# EAGLE design board-led (EAGLE 8.4.3)
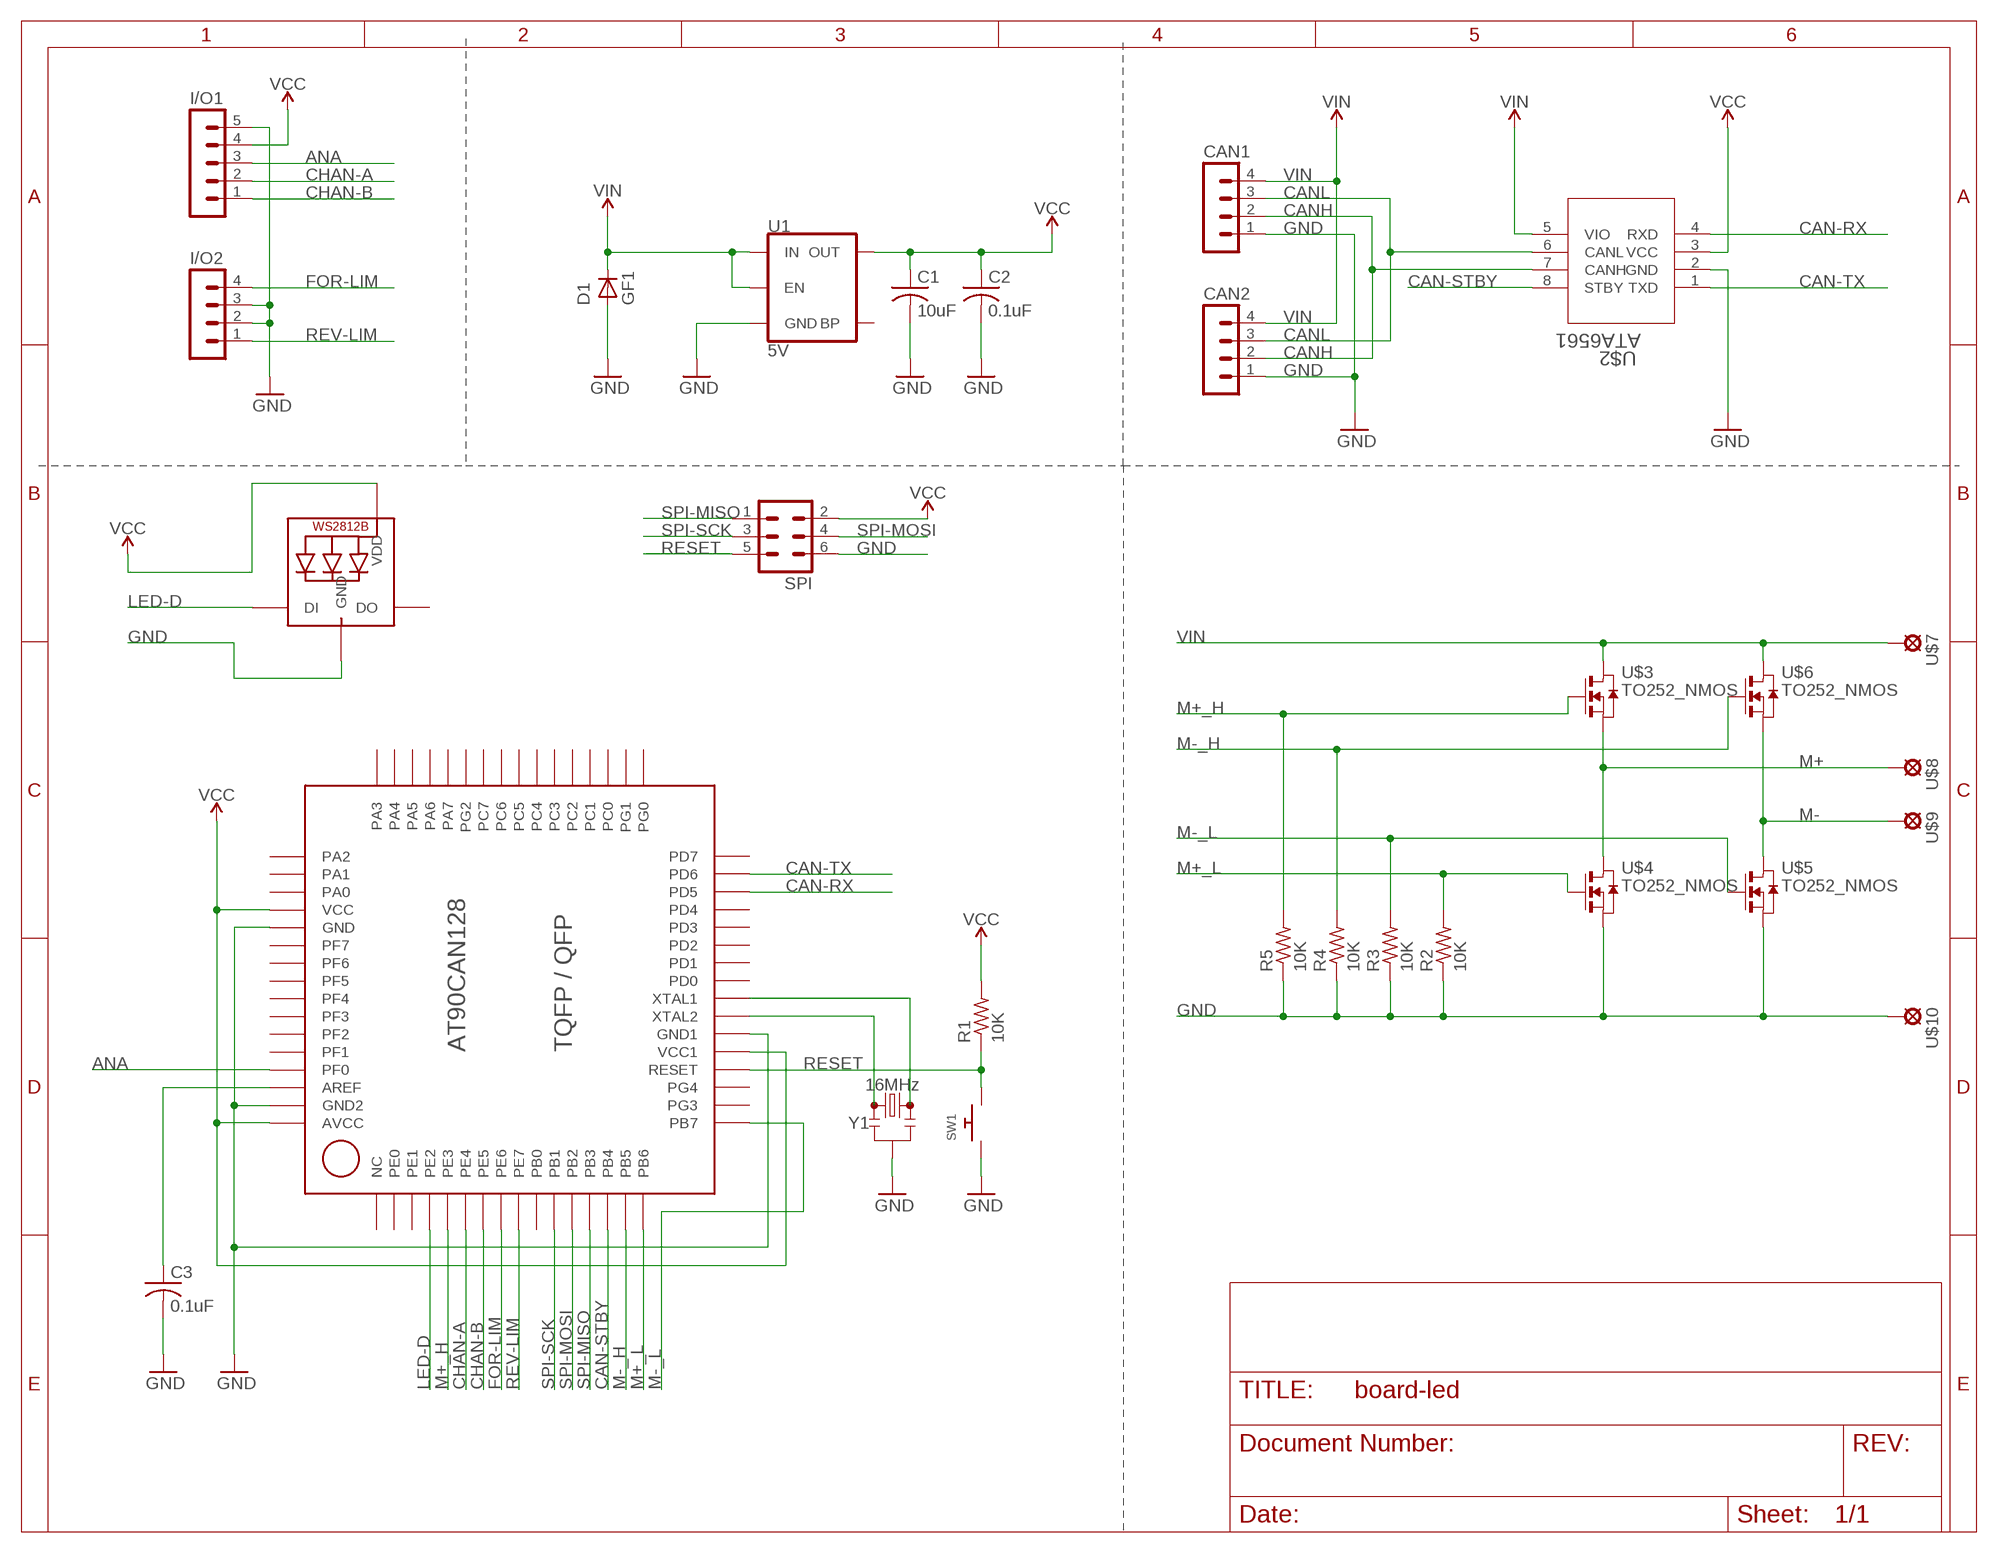
[diagram p0: schematic, sheet 1]

## Parts
C1  10uF  C-USC0603  [C0603]
C2  0.1uF  C-USC0603  [C0603]
C3  0.1uF  C-USC0603  [C0603]
CAN1  MA04-1  [MA04-1]
CAN2  MA04-1  [MA04-1]
D1  GF1  [SMA-DO214AC]
I/O1  MA05-1  [MA05-1]
I/O2  MA04-1  [MA04-1]
LED1  WS2812B3535  [LED3535]
R1  10K  R-US_R0603  [R0603]
R2  10K  R-US_R0603  [R0603]
R3  10K  R-US_R0603  [R0603]
R4  10K  R-US_R0603  [R0603]
R5  10K  R-US_R0603  [R0603]
SPI  MA03-2  [MA03-2]
SW1  SWITCH_PUSHBUTTONEVQ-PE  [TACT_PANA-EVQ]
U1  5V  V_REG_MIC52055V  [SOT23-5]
U$1  AT90CAN128  [QFP64/TQFP64]
U$2  ATA6561  [SO8]
U$3  TO252_NMOS  [TO252]
U$4  TO252_NMOS  [TO252]
U$5  TO252_NMOS  [TO252]
U$6  TO252_NMOS  [TO252]
U$7  SOLPAD  [SOLPAD]
U$8  SOLPAD  [SOLPAD]
U$9  SOLPAD  [SOLPAD]
U$10  SOLPAD  [SOLPAD]
Y1  16MHz  RESONATOR-16MHZSMD_3.2X1.3  [RESONATOR-SMD-3.2X1.3]

## Nets
ANA: I/O1.3 U$1.61(PF0)
CAN-RX: U$1.30(PD5) U$2.4(RXD)
CAN-STBY: U$1.14(PB4) U$2.8(STBY)
CAN-TX: U$1.31(PD6) U$2.1(TXD)
CANH: CAN1.2 CAN2.2 U$2.7(CANH)
CANL: CAN1.3 CAN2.3 U$2.6(CANL)
CHAN-A: I/O1.2 U$1.6(PE4)
CHAN-B: I/O1.1 U$1.7(PE5)
FOR-LIM: I/O2.4 U$1.8(PE6)
GND: C1.2 C2.2 C3.2 CAN1.1 CAN2.1 D1.A I/O1.5 I/O2.2 I/O2.3 LED1.4(GND) R2.1 R3.1 R4.1 R5.1 SPI.6 SW1.P$1 U1.2(GND) U$1.22(GND1) U$1.53(GND) U$1.63(GND2) U$2.2(GND) U$4.2(S) U$5.2(S) U$10.P$1(MP) Y1.2
LED-D: LED1.1(DI) U$1.4(PE2)
M+: U$3.2(S) U$4.3(D) U$8.P$1(MP)
M+_H: R5.2 U$1.5(PE3) U$3.1(G)
M+_L: R2.2 U$1.16(PB6) U$4.1(G)
M-: U$5.3(D) U$6.2(S) U$9.P$1(MP)
M-_H: R4.2 U$1.15(PB5) U$6.1(G)
M-_L: R3.2 U$1.17(PB7) U$5.1(G)
N$2: U$1.23(XTAL2) Y1.1
N$3: U$1.24(XTAL1) Y1.3
N$4: C3.1 U$1.62(AREF)
RESET: R1.1 SPI.5 SW1.P$2 U$1.20(RESET)
REV-LIM: I/O2.1 U$1.9(PE7)
SPI-MISO: SPI.1 U$1.13(PB3)
SPI-MOSI: SPI.4 U$1.12(PB2)
SPI-SCK: SPI.3 U$1.11(PB1)
VCC: C1.1 C2.1 I/O1.4 LED1.2(VDD) R1.2 SPI.2 U1.5(OUT) U$1.21(VCC1) U$1.52(VCC) U$1.64(AVCC) U$2.3(VCC)
VIN: CAN1.4 CAN2.4 D1.K(C) U1.1(IN) U1.3(EN) U$2.5(VIO) U$3.3(D) U$6.3(D) U$7.P$1(MP)
Unconnected: LED1.3(DO) U1.4(BP) U$1.1(NC) U$1.2(PE0) U$1.3(PE1) U$1.10(PB0) U$1.18(PG3) U$1.19(PG4) U$1.25(PD0) U$1.26(PD1) U$1.27(PD2) U$1.28(PD3) U$1.29(PD4) U$1.32(PD7) U$1.33(PG0) U$1.34(PG1) U$1.35(PC0) U$1.36(PC1) U$1.37(PC2) U$1.38(PC3) U$1.39(PC4) U$1.40(PC5) U$1.41(PC6) U$1.42(PC7) U$1.43(PG2) U$1.44(PA7) U$1.45(PA6) U$1.46(PA5) U$1.47(PA4) U$1.48(PA3) U$1.49(PA2) U$1.50(PA1) U$1.51(PA0) U$1.54(PF7) U$1.55(PF6) U$1.56(PF5) U$1.57(PF4) U$1.58(PF3) U$1.59(PF2) U$1.60(PF1)

## Library data of the parts
C1-C3 = rcl:C-US: CAPACITOR, American symbol; SPICEPREFIX: C
CAN1 CAN2 I/O2 = con-lstb:MA04-1: PIN HEADER; OC_FARNELL: unknown; OC_NEWARK: unknown
D1 = diode:GF1: DIODE
I/O1 = con-lstb:MA05-1: PIN HEADER; OC_FARNELL: unknown; OC_NEWARK: unknown
LED1 = adafruit:WS2812B
R1-R5 = rcl:R-US_: RESISTOR, American symbol; SPICEPREFIX: R
SPI = con-lstb:MA03-2: PIN HEADER; OC_FARNELL: unknown; OC_NEWARK: unknown
SW1 = adafruit:SWITCH_PUSHBUTTON: Buttons SOFTTOUCHSMD_SJ - Soft touch temporary push button (Super Junk Akihabara) Compatible with SKPMANE010 [Mouser: 688-SKPMAN] C&K_KSS = Digikey: KSS221GLFS
U1 = SparkFun-IC-Power:V_REG_MIC5205: V_REG MIC5205 Standard 3.3V, 5V, and Adjustable 150mA LDO voltage regulator in SOT-23 layout. Micrel part MIC5205. BP (by-pass) pin is used to lower output noise with 470pF cap, may be left open. On the adjustable version BP is used to set output.; PROD_ID: VREG-00823
U$1 = JetsonProj:AT90CAN128
U$2 = JetsonProj:ATA6561
U$3-U$6 = JetsonProj:TO252_NMOS
U$7-U$10 = JetsonProj:SOLPAD
Y1 = SparkFun-Clocks:RESONATOR-16MHZ: 16MHz Resonator Digikey Example <http://www.digikey.com/product-detail/en/murata-electronics-north-america/CSTCE16M0V53-R0/490-1198-1-ND/584635> Frequency: 16MHz Frequency Stability: ±0.3% Frequency Tolerance: ±0.5% Capacitance: 15pF SparkFun Products SparkFun OpenLog <https://www.sparkfun.com/products/13712> SparkFun MicroView - OLED Arduino Module <https://www.sparkfun.com/products/12923>; PROD_ID: XTAL-08900

## Board
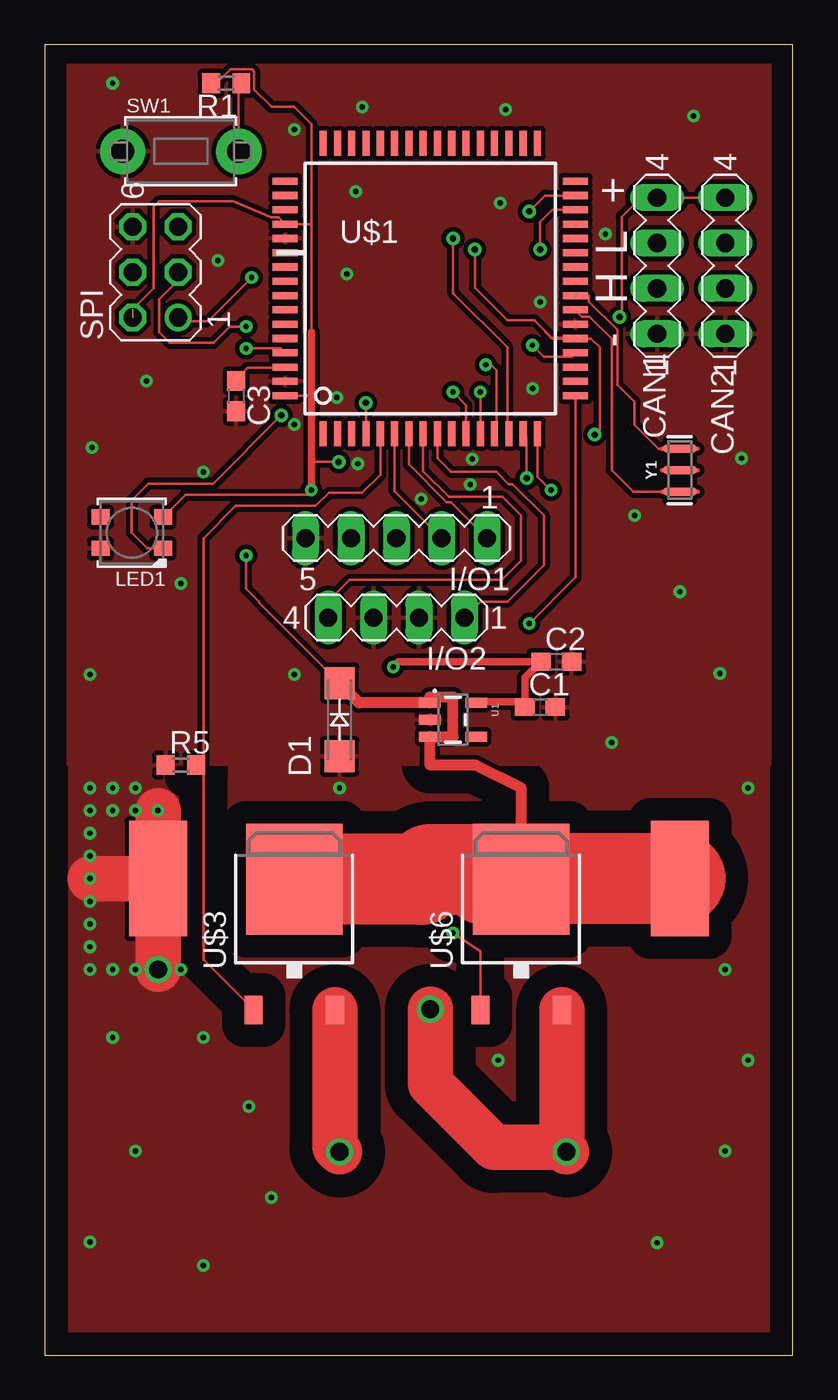
[diagram p1: board, top side]
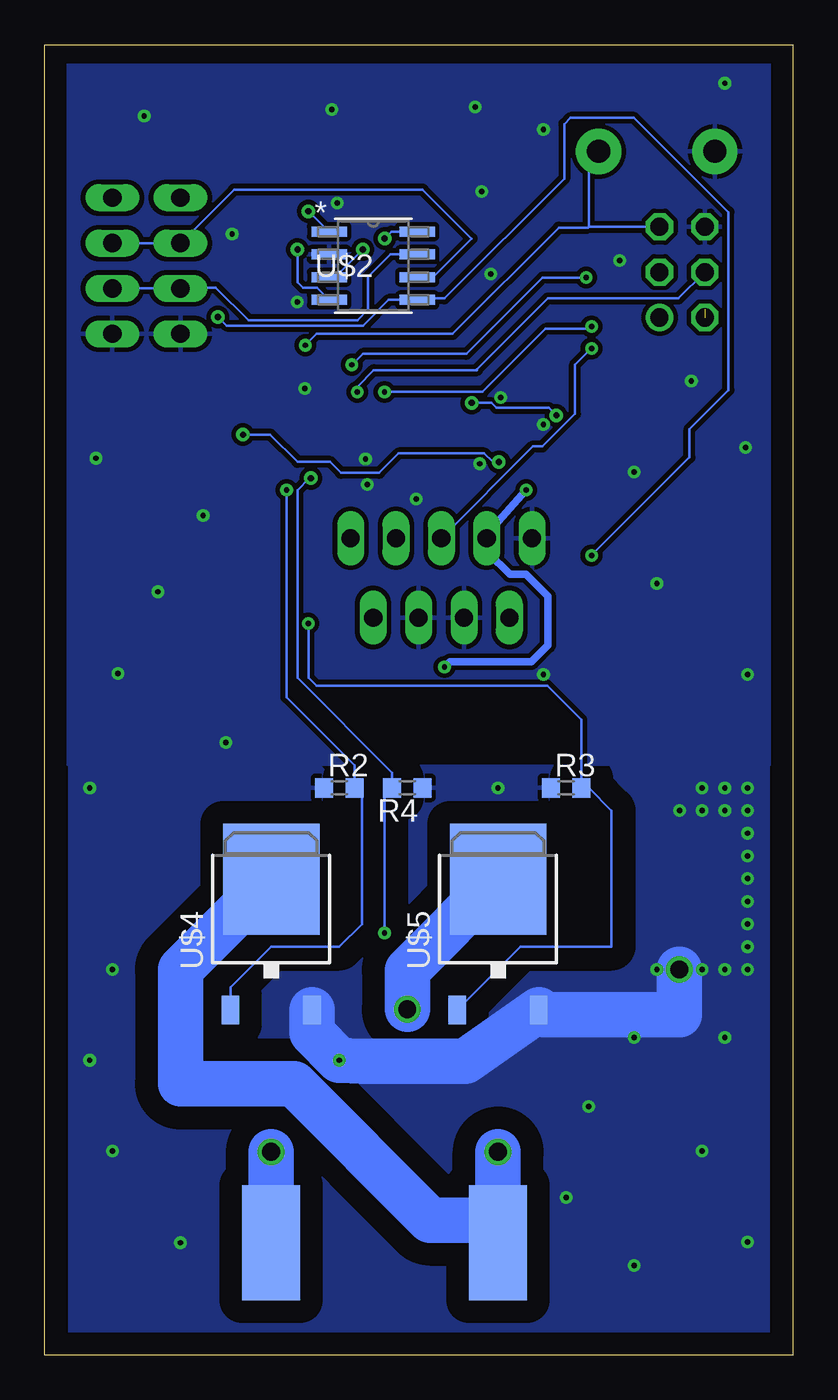
[diagram p2: board, bottom side, seen from below]

Size 41.89 x 73.33 mm. Coordinates in mm from the lower left corner, seen from the top.
Outline: 0,0 41.89,0 41.89,73.33 0,73.33 0,0
Copper layers (1*16): Top 0.035mm / dielectric 1.5mm / Bottom 0.035mm
Design rules "default": minimum track width 6mil, minimum drill 0.35mm, track to track 6mil, track to pad 6mil, pad to pad 6mil, via to via 6mil, smd to smd 6mil, copper to edge 40mil, drill to drill 6mil, minimum pad ring 10mil, minimum via ring 8mil, stop-mask expansion 4mil, vias tented up to drill 0mil, thermal gap 10mil

### Footprints (pad centres in the part's own frame; a part is rotated, then mirrored left to right if it is on the bottom)
C0603 = smd 1.1 x 1: 1 -0.85,0; 2 0.85,0
MA04-1 = drill 1.016 long: 1 -3.81,0; 2 -1.27,0; 3 1.27,0; 4 3.81,0
SMA-DO214AC = smd 1.8 x 1.7: A -2.05,0; K 2.05,0
MA05-1 = drill 1.016 long: 1 -5.08,0; 2 -2.54,0; 3 0,0; 4 2.54,0; 5 5.08,0
LED3535 = smd 1 x 0.85: 1 -1.75,0.875; 2 -1.75,-0.875; 3 1.75,-0.875; 4 1.75,0.875
R0603 = smd 1 x 1.1: 1 -0.85,0; 2 0.85,0
MA03-2 = drill 1.016: 1 -2.54,-1.27 | drill 1.016 octagon: 2 -2.54,1.27; 3 0,-1.27; 4 0,1.27; 5 2.54,-1.27; 6 2.54,1.27
TACT_PANA-EVQ = drill 1.3 pad 2.54: P$1 -3.25,0; P$2 3.25,0
SOT23-5 = smd 0.55 x 1.2: 1 -0.95,-1.3; 2 0,-1.3; 3 0.95,-1.3; 4 0.95,1.3; 5 -0.95,1.3
QFP64/TQFP64 = smd 0.4 x 1.4: 1 -6,-8.125; 2 -5.2,-8.125; 3 -4.4,-8.125; 4 -3.6,-8.125; 5 -2.8,-8.125; 6 -2,-8.125; 7 -1.2,-8.125; 8 -0.4,-8.125; 9 0.4,-8.125; 10 1.2,-8.125; 11 2,-8.125; 12 2.8,-8.125; 13 3.6,-8.125; 14 4.4,-8.125; 15 5.2,-8.125; 16 6,-8.125; 33 6,8.125; 34 5.2,8.125; 35 4.4,8.125; 36 3.6,8.125; 37 2.8,8.125; 38 2,8.125; 39 1.2,8.125; 40 0.4,8.125; 41 -0.4,8.125; 42 -1.2,8.125; 43 -2,8.125; 44 -2.8,8.125; 45 -3.6,8.125; 46 -4.4,8.125; 47 -5.2,8.125; 48 -6,8.125 | smd 1.4 x 0.4: 17 8.125,-6; 18 8.125,-5.2; 19 8.125,-4.4; 20 8.125,-3.6; 21 8.125,-2.8; 22 8.125,-2; 23 8.125,-1.2; 24 8.125,-0.4; 25 8.125,0.4; 26 8.125,1.2; 27 8.125,2; 28 8.125,2.8; 29 8.125,3.6; 30 8.125,4.4; 31 8.125,5.2; 32 8.125,6; 49 -8.125,6; 50 -8.125,5.2; 51 -8.125,4.4; 52 -8.125,3.6; 53 -8.125,2.8; 54 -8.125,2; 55 -8.125,1.2; 56 -8.125,0.4; 57 -8.125,-0.4; 58 -8.125,-1.2; 59 -8.125,-2; 60 -8.125,-2.8; 61 -8.125,-3.6; 62 -8.125,-4.4; 63 -8.125,-5.2; 64 -8.125,-6
SO8 = smd 1.981 x 0.559: 1 -2.464,1.905; 2 -2.464,0.635; 3 -2.464,-0.635; 4 -2.464,-1.905; 5 2.464,-1.905; 6 2.464,-0.635; 7 2.464,0.635; 8 2.464,1.905
TO252 = smd 1 x 1.6: 1 -2.28,-6.07; 2 2.28,-6.07 | smd 5.4 x 6.2: 3 0,1.23
SOLPAD = smd 3.251 x 6.452: P$1 0,0
RESONATOR-SMD-3.2X1.3 = smd 0.45 x 1.905: 1 -1.2,0; 2 0,0; 3 1.2,0

### Placement (x,y rotation side)
C1  27.74,36.27 0 top
C2  28.65,38.81 0 top
C3  10.72,53.67 270 top
CAN1  34.29,60.96 90 top
CAN2  38.1,60.96 90 top
D1  16.51,35.56 90 top
I/O1  19.68,45.72 180 top
I/O2  19.68,41.27 180 top
LED1  4.88,46.02 180 top
R1  10.16,71.17 180 top
R2  25.4,31.75 0 bottom
R3  12.7,31.75 0 bottom
R4  21.59,31.75 180 bottom
R5  7.62,33.02 0 top
SPI  6.2,60.6 90 top
SW1  7.62,67.36 0 top
U1  22.86,35.56 270 top
U$1  21.59,59.69 0 top
U$2  23.5,60.96 0 bottom
U$3  13.97,25.4 0 top
U$4  29.21,25.4 0 bottom
U$5  16.51,25.4 0 bottom
U$6  26.67,25.4 0 top
U$7  35.56,26.67 0 top
U$8  16.51,6.3 0 bottom
U$9  29.21,6.3 0 bottom
U$10  6.35,26.67 0 top
Y1  35.56,49.53 90 top

### Tracks (layer width: path | path; a pad name or v marks a point on that pad's centre or on a via)
ANA  (via drill 0.3)
  Top 0.152: v11.28,56.34 13.22,56.34 U$1.61
  Bottom 0.152: v11.28,56.34 12.19,55.42 12.19,52.68 14.02,50.85 14.55,50.85 I/O1.3
CAN-RX  (via drill 0.35)
  Top 0.152: v27.74,61.87 27.74,63.4 28.43,64.09 U$1.30
  Bottom 0.152: U$2.4 26.64,59.74 27.43,59.74 27.74,60.05 v27.74,61.87
CAN-STBY  (via drill 0.35)
  Top 0.152: U$1.14 25.91,51.65 25.91,56.39 22.86,59.44 v22.86,62.48
  Bottom 0.152: v22.86,62.48 22.48,62.87 U$2.8
CAN-TX  (via drill 0.35)
  Top 0.152: v27.13,64.01 28.01,64.89 U$1.31
  Bottom 0.152: U$2.1 27.1,64.01 v27.13,64.01
CANH
  Bottom 0.152: U$2.7 22.53,61.59 23.77,60.35 23.77,58.52 24.38,57.91 30.48,57.91 32.31,59.74 34.24,59.74 CAN1.2 CAN2.2
CANL
  Bottom 0.152: CAN2.3 CAN1.3 31.29,65.23 20.73,65.23 17.98,62.48 20.14,60.33 U$2.6
CHAN-A
  Top 0.152: I/O1.2 19.59,48.35 U$1.6
CHAN-B
  Top 0.152: I/O1.1 22.76,47.73 22.5,47.73 20.39,49.84 U$1.7
FOR-LIM
  Top 0.152: I/O2.4 15.88,42.14 15.85,42.16 17.07,43.38 25.6,43.38 26.67,44.45 26.67,46.99 25.63,48.03 22.63,48.03 21.19,49.47 U$1.8
GND  (via drill 0.3, 1)
  Top 2.54: v6.35,21.59 U$10.P$1 | U$10.P$1 v2.54,26.67 | U$10.P$1 v6.35,30.48
  Bottom 2.54: v6.35,21.59 6.35,19.05 13.95,19.05 U$5.2 18.32,16.46 24.13,16.46 v25.4,16.51 26.93,18.04 U$4.2
  other vias: 27.33,54.1 3.81,71.17 36.32,69.34 16.36,53.59 17.42,65.13 25.5,64.47 25.81,69.7 27.74,58.93 35.56,42.72 17.78,69.85 13.97,68.58 2.64,50.8 7.62,43.18 21.08,47.9 39.01,50.19 17.53,49.89 37.8,38.15 2.54,38.1 23.93,50.14 31.75,34.29 39.37,31.75 16.51,31.75 16.92,60.5 13.97,38.1 38.1,21.59 38.1,11.43 11.43,13.92 2.54,6.35 8.89,5.03 34.29,6.3 13.97,52.07 33.02,46.99 8.89,49.43 23.83,48.72 5.69,54.51 31.39,62.74 9.7,61.26 39.37,16.51 12.7,8.84 8.89,17.78 5.08,11.43 3.81,17.78 3.81,21.59 2.54,25.4 2.54,27.94 2.54,31.75 3.81,31.75 5.08,31.75 2.54,30.48 3.81,30.48 5.08,30.48 2.54,29.21 2.54,24.13 2.54,22.86 2.54,21.59 5.08,21.59 7.62,21.59
  pour Top (isolate 1.27): 1.27,1.27 1.27,33.02 40.64,33.02 40.64,1.27
  pour Bottom (isolate 1.27): 1.27,1.27 1.27,33.02 40.64,33.02 40.64,1.27
  pour Bottom (isolate 0.254): 1.27,33.02 1.27,72.39 40.64,72.39 40.64,33.02
  pour Top (isolate 0.254): 1.27,33.02 1.27,72.39 40.64,72.39 40.64,33.02
LED-D  (via drill 0.35)
  Top 0.152: U$1.4 v17.99,53.28 v17.98,53.29 | v13.24,52.59 9.42,48.77 5.79,48.77 4.88,47.85 4.88,46.02 5.75,45.15 LED1.1
  Bottom 0.152: v17.98,53.29 16.88,53.29 16.6,53.01 13.66,53.01 v13.24,52.59
M+  (via drill 1)
  Top 2.54: U$3.2 16.25,11.64 v16.51,11.38
  Bottom 2.54: 16.51,7.57 v16.51,11.38 | 16.51,7.57 U$8.P$1 | U$4.3 29.25,26.63 34.29,21.59 34.29,15.19 27.94,15.19 20.32,7.57 16.51,7.57
M+_H
  Top 0.152: U$3.1 8.89,22.13 8.89,32.6 R5.2 8.89,33.44 8.89,45.72 10.7,47.53 15.18,47.53 15.91,48.26 17.78,48.26 18.79,49.27 U$1.5
M+_L  (via drill 0.3)
  Top 0.152: U$1.16 27.59,49.17 v28.35,48.41
  Bottom 0.152: U$4.1 31.49,20.58 29.21,22.86 25.4,22.86 24.13,24.13 24.13,31.33 R2.2 24.55,33.02 28.35,36.82 v28.35,48.41
M-  (via drill 1)
  Top 2.54: 28.95,11.64 U$6.2 | 28.95,11.64 v29.21,11.38 | 28.95,11.64 25.14,11.64 21.59,15.19 v21.59,19.36
  Bottom 2.54: v29.21,11.38 U$9.P$1 | U$5.3 21.59,21.55 v21.59,19.36
M-_H  (via drill 0.3, 0.35)
  Top 0.152: U$6.1 24.39,22.6 v22.86,23.62 | v26.98,49.07 26.98,51.37 U$1.15
  Bottom 0.152: v22.86,23.62 22.86,31.33 R4.2 22.44,32.6 27.74,37.9 27.74,48.41 27.08,49.07 v26.98,49.07
M-_L  (via drill 0.3)
  Top 0.152: U$1.17 29.71,43.53 v27.13,40.95
  Bottom 0.152: U$5.1 15.26,22.86 10.16,22.86 10.16,30.48 11.43,31.75 R3.2 11.85,35.56 13.76,37.47 26.67,37.47 27.13,37.92 v27.13,40.95
N$2
  Top 0.152: U$1.23 30.09,58.12 30.51,58.12 31.75,56.88 31.75,49.53 32.95,48.33 Y1.1
N$3
  Top 0.152: U$1.24 30.48,59.29 30.48,58.95 32.05,57.37 32.05,54.3 33.02,53.34 33.02,52.07 34.36,50.73 Y1.3
N$4
  Top 0.152: C3.1 10.93,54.83 11.35,55.24 13.42,55.24 U$1.62
RESET  (via drill 0.3)
  Top 0.152: SW1.P$2 10.87,71.03 R1.1 | v27.3,56.52 27.94,55.88 29.5,55.88 U$1.20
  Bottom 0.152: SW1.P$2 10.87,66.65 11.55,66.38 11.43,66.26 11.43,63.14 | 11.43,63.14 SPI.5 | v27.3,56.52 26.67,57.15 19.05,57.15 13.11,63.09 11.48,63.09 11.43,63.14
REV-LIM
  Top 0.152: I/O2.1 24.38,42.16 25.91,42.16 27.94,44.2 27.94,46.99 26.18,48.74 25.97,48.74 25.29,49.43 22.76,49.43 21.99,50.2 U$1.9
SPI-MISO  (via drill 0.3)
  Top 0.152: SPI.1 7.67,57.86 9.14,57.86 v11.58,60.3 | U$1.13 25.3,51.67 25.3,55.12 24.99,55.42 v24.69,55.42
  Bottom 0.152: v24.69,55.42 24.08,56.03 18.29,56.03 14.02,60.3 v11.58,60.3
SPI-MOSI  (via drill 0.3)
  Top 0.152: U$1.12 v24.38,53.9
  Bottom 0.152: v24.38,53.9 24.38,54.2 23.47,55.12 17.68,55.12 17.68,55.17 13.72,59.13 6.4,59.13 SPI.4
SPI-SCK  (via drill 0.3)
  Top 0.152: SPI.3 7.47,60.15 6.4,59.08 6.4,57.25 7.01,56.64 9.45,56.64 10.36,57.56 v11.28,57.56 | v22.86,53.9 23.59,53.17 U$1.11
  Bottom 0.152: v22.86,53.9 17.37,53.9 13.84,57.43 11.4,57.43 v11.28,57.56
VCC  (via drill 0.3, 0.35)  (1 unrouted)
  Top 0.152: 14.94,63.35 14.88,63.29 U$1.52 13.09,63.66 12.67,63.66 10.55,64.57 6.4,64.57 6.1,64.26 6.1,59.69 4.93,58.52 | 14.94,63.35 14.94,57.25 14.94,53.9 14.73,53.69 U$1.64 | U$1.21 29.66,56.95 28.35,56.95 28.04,57.25 | R1.2 9.64,71.17 10.41,71.95 11.61,71.95 11.74,71.81 11.74,70.81 12.7,69.85 13.97,69.85 14.94,68.89 14.94,63.35 | v30.79,51.51 31.09,51.82 31.09,56.39 30.59,56.89 U$1.21 | v24.08,61.87 24.08,59.74 25.91,57.91 27.43,57.91 28.45,56.89 U$1.21 | LED1.2 7.88,48.16 14.68,48.16 v14.94,48.41 | v16.46,49.99 14.94,49.99
  Top 0.406: 14.94,57.25 14.94,49.99 v14.94,48.41 | U1.5 24.27,36.56 26.59,36.56 C1.1 26.89,37.9 C2.1 19.81,38.81 v19.51,38.51
  Bottom 0.152: U$2.3 25.63,60.33 v24.08,61.87 | v16.46,49.99 16.8,49.99 17.29,50.47 22.07,50.47 23.16,49.38 25.3,49.38 25.91,49.99 27.74,49.99 29.26,51.51 v30.79,51.51
  Bottom 0.406: v14.94,48.41 17.14,45.9 I/O1.4 17.07,45.64 17.07,44.91 15.85,43.69 14.94,43.69 13.72,42.47 13.72,39.73 14.63,38.81 19.2,38.81 v19.51,38.51
VIN  (via drill 0.3, 0.35)
  Top 0.152: D1.K 12.01,42.11 12.01,42.15 11.28,42.88 v11.28,44.76 | v32.19,58.1 32.31,58.22 32.31,63.7 33.38,64.77 CAN1.4 CAN2.4
  Top 0.61: U$6.3 26.67,31.75 24.13,33.02 21.59,33.02 21.56,33.05 U1.3 22.86,34.61 22.86,36.83 21.56,36.83 U1.1 17.61,36.51 D1.K
  Top 5.08: U$7.P$1 26.67,26.67 U$6.3 24.67,26.63 24.12,27.18 21.6,27.18 21.05,26.63 U$3.3
  Bottom 0.152: 21.61,59.05 U$2.5 | U$2.5 20.95,59.13 19.51,59.13 12.8,65.84 12.8,68.89 12.45,69.24 8.89,69.24 3.61,63.96 3.61,54 5.79,51.82 5.79,50.24 v11.28,44.76 | U$2.5 22.63,59.05 24.08,57.61 31.7,57.61 v32.19,58.1

### Text on the board
tNames: + | L | H | -